# Altium schematic sheet QCLogic Rev A Sht0 Top.SchDoc
size A4
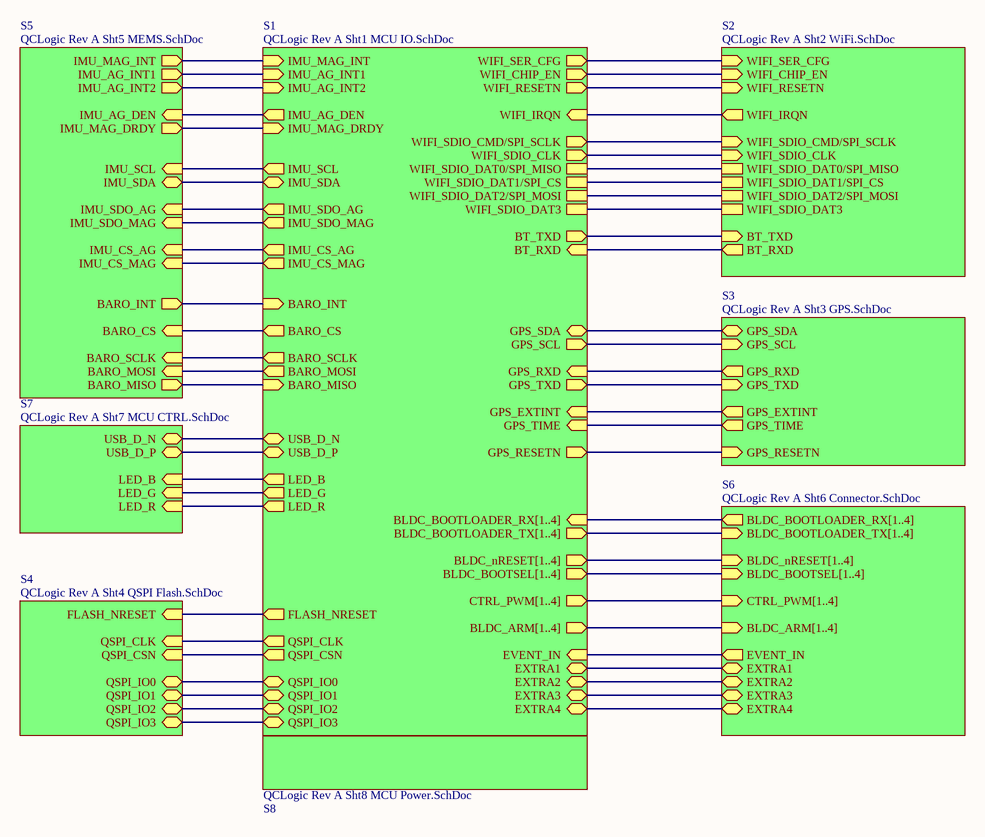
[diagram p0: QCLogic Rev A Sht0 Top.SchDoc]

## Sub-sheets
S1 = QCLogic Rev A Sht1 MCU IO.SchDoc: IMU_MAG_INT (in), IMU_AG_INT1 (in), IMU_AG_INT2 (in), IMU_AG_DEN (out), IMU_MAG_DRDY (in), IMU_SCL (out), IMU_SDA (bidir), IMU_SDO_AG (out), IMU_SDO_MAG (out), IMU_CS_AG (out), IMU_CS_MAG (out), BARO_INT (in), BARO_CS (out), BARO_SCLK (out), BARO_MOSI (out), BARO_MISO (in), USB_D_N (bidir), USB_D_P (bidir), WIFI_SER_CFG (out), WIFI_CHIP_EN (out), WIFI_RESETN (out), WIFI_IRQN (in), WIFI_SDIO_CMD/SPI_SCLK (out), WIFI_SDIO_CLK (out), WIFI_SDIO_DAT0/SPI_MISO, WIFI_SDIO_DAT1/SPI_CS, WIFI_SDIO_DAT2/SPI_MOSI, WIFI_SDIO_DAT3, BT_TXD (out), BT_RXD (in), GPS_RXD (in), GPS_TXD (out), GPS_EXTINT (in), GPS_TIME (in), GPS_RESETN (out), GPS_SCL (out), GPS_SDA (bidir), BLDC_BOOTLOADER_RX[1..4] (in), BLDC_BOOTLOADER_TX[1..4] (out), BLDC_nRESET[1..4] (out), BLDC_BOOTSEL[1..4] (out), CTRL_PWM[1..4] (out), FLASH_NRESET (out), QSPI_CLK (out), QSPI_CSN (out), QSPI_IO0 (bidir), QSPI_IO1 (bidir), QSPI_IO2 (bidir), QSPI_IO3 (bidir), LED_B (out), LED_G (out), LED_R (out), BLDC_ARM[1..4] (out), EVENT_IN (in), EXTRA1 (bidir), EXTRA2 (bidir), EXTRA3 (bidir), EXTRA4 (bidir)
S2 = QCLogic Rev A Sht2 WiFi.SchDoc: WIFI_SER_CFG (in), WIFI_CHIP_EN (in), WIFI_RESETN (in), WIFI_IRQN (out), WIFI_SDIO_CMD/SPI_SCLK (in), WIFI_SDIO_CLK (in), WIFI_SDIO_DAT0/SPI_MISO, WIFI_SDIO_DAT1/SPI_CS, WIFI_SDIO_DAT2/SPI_MOSI, WIFI_SDIO_DAT3, BT_TXD (in), BT_RXD (out)
S3 = QCLogic Rev A Sht3 GPS.SchDoc: GPS_SDA (bidir), GPS_SCL (in), GPS_RXD (out), GPS_TXD (in), GPS_EXTINT (out), GPS_TIME (out), GPS_RESETN (in)
S4 = QCLogic Rev A Sht4 QSPI Flash.SchDoc: FLASH_NRESET (in), QSPI_CLK (in), QSPI_CSN (in), QSPI_IO0 (bidir), QSPI_IO1 (bidir), QSPI_IO2 (bidir), QSPI_IO3 (bidir)
S5 = QCLogic Rev A Sht5 MEMS.SchDoc: IMU_MAG_INT (out), IMU_AG_INT1 (out), IMU_AG_INT2 (out), IMU_AG_DEN (in), IMU_MAG_DRDY (out), IMU_SCL (in), IMU_SDA (bidir), IMU_SDO_AG (in), IMU_SDO_MAG (in), IMU_CS_AG (in), IMU_CS_MAG (in), BARO_INT (out), BARO_CS (in), BARO_SCLK (in), BARO_MOSI (in), BARO_MISO (out)
S6 = QCLogic Rev A Sht6 Connector.SchDoc: BLDC_BOOTLOADER_RX[1..4] (out), BLDC_BOOTLOADER_TX[1..4] (in), BLDC_nRESET[1..4] (in), BLDC_BOOTSEL[1..4] (in), CTRL_PWM[1..4] (in), BLDC_ARM[1..4] (in), EVENT_IN (out), EXTRA1 (bidir), EXTRA2 (bidir), EXTRA3 (bidir), EXTRA4 (bidir)
S7 = QCLogic Rev A Sht7 MCU CTRL.SchDoc: USB_D_N (bidir), USB_D_P (bidir), LED_B (in), LED_G (in), LED_R (in)
S8 = QCLogic Rev A Sht8 MCU Power.SchDoc: no entries

## Nets
(unnamed): sheet S1/IMU_MAG_INT, sheet S5/IMU_MAG_INT
(unnamed): sheet S1/IMU_AG_INT1, sheet S5/IMU_AG_INT1
(unnamed): sheet S1/IMU_AG_INT2, sheet S5/IMU_AG_INT2
(unnamed): sheet S1/IMU_AG_DEN, sheet S5/IMU_AG_DEN
(unnamed): sheet S1/IMU_MAG_DRDY, sheet S5/IMU_MAG_DRDY
(unnamed): sheet S1/IMU_SCL, sheet S5/IMU_SCL
(unnamed): sheet S1/IMU_SDA, sheet S5/IMU_SDA
(unnamed): sheet S1/IMU_SDO_AG, sheet S5/IMU_SDO_AG
(unnamed): sheet S1/IMU_SDO_MAG, sheet S5/IMU_SDO_MAG
(unnamed): sheet S1/IMU_CS_AG, sheet S5/IMU_CS_AG
(unnamed): sheet S1/IMU_CS_MAG, sheet S5/IMU_CS_MAG
(unnamed): sheet S1/BARO_INT, sheet S5/BARO_INT
(unnamed): sheet S1/BARO_CS, sheet S5/BARO_CS
(unnamed): sheet S1/BARO_SCLK, sheet S5/BARO_SCLK
(unnamed): sheet S1/BARO_MOSI, sheet S5/BARO_MOSI
(unnamed): sheet S1/BARO_MISO, sheet S5/BARO_MISO
(unnamed): sheet S1/USB_D_N, sheet S7/USB_D_N
(unnamed): sheet S1/USB_D_P, sheet S7/USB_D_P
(unnamed): sheet S1/WIFI_SER_CFG, sheet S2/WIFI_SER_CFG
(unnamed): sheet S1/WIFI_CHIP_EN, sheet S2/WIFI_CHIP_EN
(unnamed): sheet S1/WIFI_RESETN, sheet S2/WIFI_RESETN
(unnamed): sheet S1/WIFI_IRQN, sheet S2/WIFI_IRQN
(unnamed): sheet S1/WIFI_SDIO_CMD/SPI_SCLK, sheet S2/WIFI_SDIO_CMD/SPI_SCLK
(unnamed): sheet S1/WIFI_SDIO_CLK, sheet S2/WIFI_SDIO_CLK
(unnamed): sheet S1/WIFI_SDIO_DAT0/SPI_MISO, sheet S2/WIFI_SDIO_DAT0/SPI_MISO
(unnamed): sheet S1/WIFI_SDIO_DAT1/SPI_CS, sheet S2/WIFI_SDIO_DAT1/SPI_CS
(unnamed): sheet S1/WIFI_SDIO_DAT2/SPI_MOSI, sheet S2/WIFI_SDIO_DAT2/SPI_MOSI
(unnamed): sheet S1/WIFI_SDIO_DAT3, sheet S2/WIFI_SDIO_DAT3
(unnamed): sheet S1/BT_TXD, sheet S2/BT_TXD
(unnamed): sheet S1/BT_RXD, sheet S2/BT_RXD
(unnamed): sheet S1/GPS_RXD, sheet S3/GPS_RXD
(unnamed): sheet S1/GPS_TXD, sheet S3/GPS_TXD
(unnamed): sheet S1/GPS_EXTINT, sheet S3/GPS_EXTINT
(unnamed): sheet S1/GPS_TIME, sheet S3/GPS_TIME
(unnamed): sheet S1/GPS_RESETN, sheet S3/GPS_RESETN
(unnamed): sheet S1/GPS_SCL, sheet S3/GPS_SCL
(unnamed): sheet S1/GPS_SDA, sheet S3/GPS_SDA
(unnamed): sheet S1/FLASH_NRESET, sheet S4/FLASH_NRESET
(unnamed): sheet S1/QSPI_CLK, sheet S4/QSPI_CLK
(unnamed): sheet S1/QSPI_CSN, sheet S4/QSPI_CSN
(unnamed): sheet S1/QSPI_IO0, sheet S4/QSPI_IO0
(unnamed): sheet S1/QSPI_IO1, sheet S4/QSPI_IO1
(unnamed): sheet S1/QSPI_IO2, sheet S4/QSPI_IO2
(unnamed): sheet S1/QSPI_IO3, sheet S4/QSPI_IO3
(unnamed): sheet S1/LED_B, sheet S7/LED_B
(unnamed): sheet S1/LED_G, sheet S7/LED_G
(unnamed): sheet S1/LED_R, sheet S7/LED_R
(unnamed): sheet S1/EVENT_IN, sheet S6/EVENT_IN
(unnamed): sheet S1/EXTRA1, sheet S6/EXTRA1
(unnamed): sheet S1/EXTRA2, sheet S6/EXTRA2
(unnamed): sheet S1/EXTRA3, sheet S6/EXTRA3
(unnamed): sheet S1/EXTRA4, sheet S6/EXTRA4

## Buses and harness runs
bus sheet S1/BLDC_ARM[1..4] = sheet S6/BLDC_ARM[1..4]
bus sheet S1/BLDC_BOOTLOADER_RX[1..4] = sheet S6/BLDC_BOOTLOADER_RX[1..4]
bus sheet S1/BLDC_BOOTLOADER_TX[1..4] = sheet S6/BLDC_BOOTLOADER_TX[1..4]
bus sheet S1/BLDC_BOOTSEL[1..4] = sheet S6/BLDC_BOOTSEL[1..4]
bus sheet S1/BLDC_nRESET[1..4] = sheet S6/BLDC_nRESET[1..4]
bus sheet S1/CTRL_PWM[1..4] = sheet S6/CTRL_PWM[1..4]